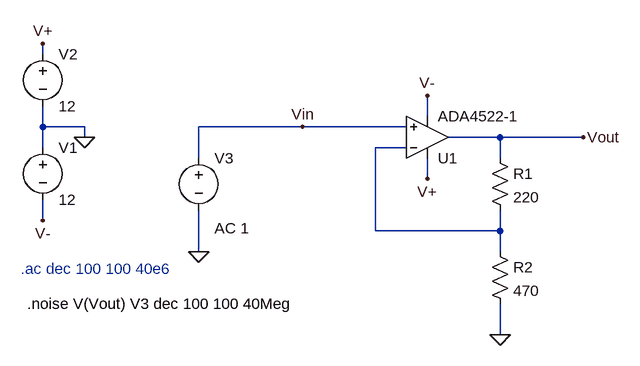
[diagram p0: schematic NonInvertingx1.5Gain.asc]
NonInvertingx1.5Gain.asc, the LTspice schematic file:
Version 4
SHEET 1 880 680
WIRE -336 0 -336 -16
WIRE 256 96 256 64
WIRE -336 112 -336 80
WIRE -272 112 -336 112
WIRE 64 112 -96 112
WIRE 224 112 64 112
WIRE -272 128 -272 112
WIRE 368 128 288 128
WIRE 496 128 368 128
WIRE -336 144 -336 112
WIRE 224 144 176 144
WIRE -96 160 -96 112
WIRE 368 160 368 128
WIRE 256 192 256 160
WIRE -336 256 -336 224
WIRE 176 272 176 144
WIRE 368 272 368 240
WIRE 368 272 176 272
WIRE -96 304 -96 240
WIRE 368 304 368 272
WIRE 368 432 368 384
FLAG -272 128 0
FLAG -336 256 V-
FLAG -336 -16 V+
FLAG 256 192 V+
FLAG 256 64 V-
FLAG 496 128 Vout
FLAG 64 112 Vin
FLAG -96 304 0
FLAG 368 432 0
SYMBOL Opamps\\ADA4522-1 256 192 M180
SYMATTR InstName U1
SYMBOL voltage -336 128 R0
WINDOW 123 0 0 Left 0
WINDOW 39 0 0 Left 0
SYMATTR InstName V1
SYMATTR Value 12
SYMBOL voltage -336 -16 R0
WINDOW 123 0 0 Left 0
WINDOW 39 0 0 Left 0
SYMATTR InstName V2
SYMATTR Value 12
SYMBOL voltage -96 144 R0
WINDOW 123 24 124 Left 2
WINDOW 39 0 0 Left 0
SYMATTR InstName V3
SYMATTR Value ""
SYMATTR Value2 AC 1
SYMBOL res 352 144 R0
SYMATTR InstName R1
SYMATTR Value 220
SYMBOL res 352 288 R0
SYMATTR InstName R2
SYMATTR Value 470
TEXT -370 330 Left 2 ;.ac dec 100 100 40e6
TEXT -360 384 Left 2 !.noise V(Vout) V3 dec 100 100 40Meg

The netlist it stands for:
* NonInvertingx1.5Gain.asc
XU1 Vin N001 V+ V- Vout ADA4522-1  ; pins In+ In- V+ V- OUT
V1 0 V- 12
V2 V+ 0 12
V3 Vin 0 AC 1
R1 Vout N001 220
R2 N001 0 470
* .ac dec 100 100 40e6
.noise V(Vout) V3 dec 100 100 40Meg
.backanno
.end